# EAGLE design StepperSynth2.4_Interface (EAGLE 9.2.2)
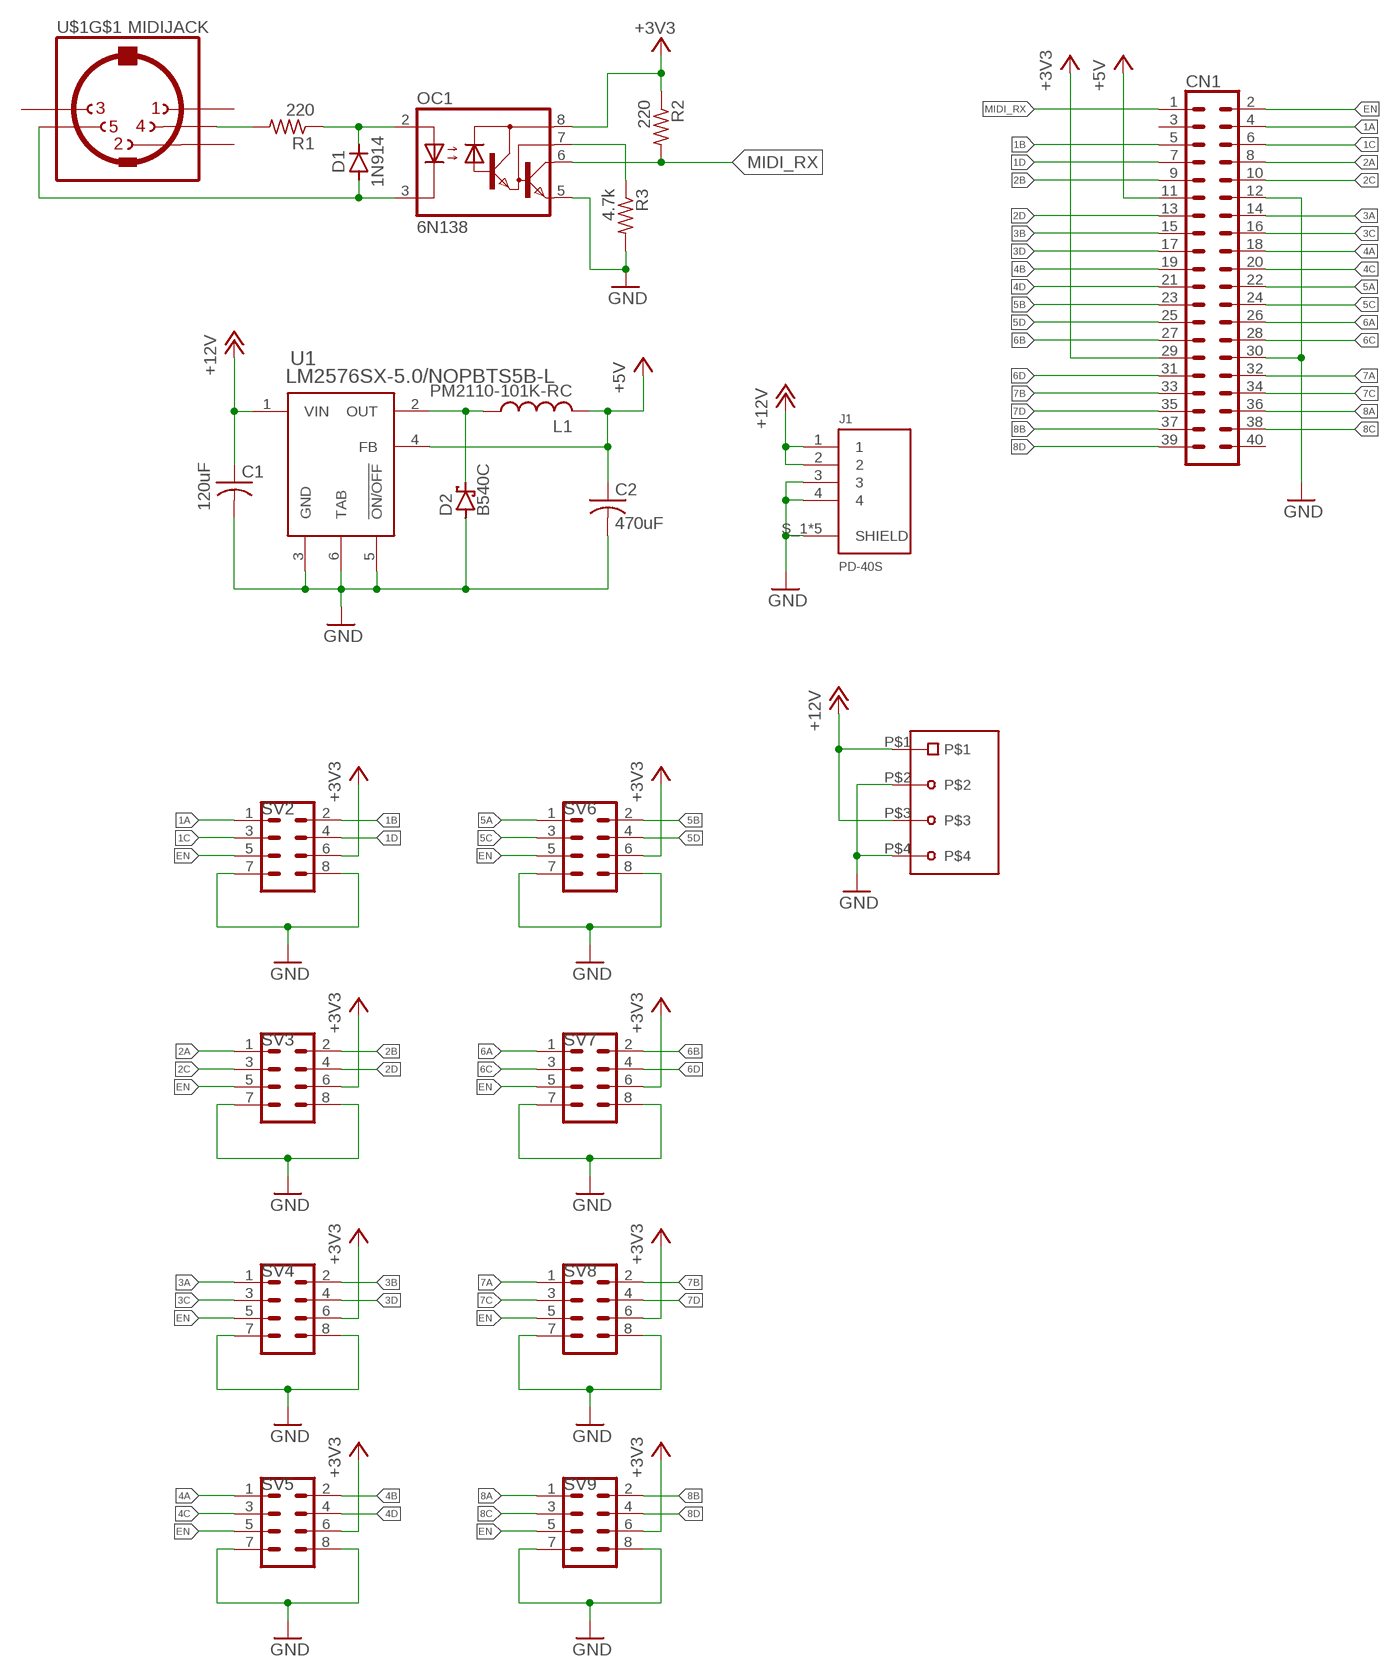
[diagram p0: schematic, sheet 1]

## Parts
C1  120uF  20SVPF120MPCAP_SVP_C6-L  [PCAP_SVP_C6-L]
C2  470uF  UUD1A471MNL1GSU2-P-L  [U2-P-L]
CN1  CONN_20X2_LOCK  [1X20_LOCK]
CN2  SCREW_TERMINAL_4POS_5MM  [4_POS-SCREW_TERM]
D1  1N914  [DO35-7]
D2  B540C  SCHOTTKY-DIODESMC  [SMC]
J1  PD-40S  [CUI_PD-40S]
L1  PM2110-101K-RC  [IND_PM2110]
OC1  6N138  [DIL08]
R1  220  R-US_0204/7  [0204/7]
R2  220  R-US_0204/7  [0204/7]
R3  4.7k  R-US_0204/7  [0204/7]
SV2  CONN_4X2_LOCK  [1X04_LOCK]
SV3  CONN_4X2_LOCK  [1X04_LOCK]
SV4  CONN_4X2_LOCK  [1X04_LOCK]
SV5  CONN_4X2_LOCK  [1X04_LOCK]
SV6  CONN_4X2_LOCK  [1X04_LOCK]
SV7  CONN_4X2_LOCK  [1X04_LOCK]
SV8  CONN_4X2_LOCK  [1X04_LOCK]
SV9  CONN_4X2_LOCK  [1X04_LOCK]
U1  LM2576SX-5.0/NOPBTS5B-L  [TS5B-L]
U$1  MIDIJACK  [CP-2350]

## Nets
1A: CN1.4 SV2.1
1B: CN1.5 SV2.2
1C: CN1.6 SV2.3
1D: CN1.7 SV2.4
2A: CN1.8 SV3.1
2B: CN1.9 SV3.2
2C: CN1.10 SV3.3
2D: CN1.13 SV3.4
3A: CN1.14 SV4.1
3B: CN1.15 SV4.2
3C: CN1.16 SV4.3
3D: CN1.17 SV4.4
4A: CN1.18 SV5.1
4B: CN1.19 SV5.2
4C: CN1.20 SV5.3
4D: CN1.21 SV5.4
5A: CN1.22 SV6.1
5B: CN1.23 SV6.2
5C: CN1.24 SV6.3
5D: CN1.25 SV6.4
6A: CN1.26 SV7.1
6B: CN1.27 SV7.2
6C: CN1.28 SV7.3
6D: CN1.31 SV7.4
7A: CN1.32 SV8.1
7B: CN1.33 SV8.2
7C: CN1.34 SV8.3
7D: CN1.35 SV8.4
8A: CN1.36 SV9.1
8B: CN1.37 SV9.2
8C: CN1.38 SV9.3
8D: CN1.39 SV9.4
+3V3: CN1.29 OC1.8(VCC) R2.1 SV2.6 SV3.6 SV4.6 SV5.6 SV6.6 SV7.6 SV8.6 SV9.6
+5V: C2.1(+) CN1.11 L1.2 U1.4(FB)
+12V: C1.1(+) CN2.P$1 CN2.P$3 J1.1 J1.2 U1.1(VIN)
EN: CN1.2 SV2.5 SV3.5 SV4.5 SV5.5 SV6.5 SV7.5 SV8.5 SV9.5
GND: C1.2(-) C2.2(-) CN1.12 CN1.30 CN2.P$2 CN2.P$4 D2.A J1.3 J1.4 J1.S_1(SHIELD) J1.S_2(SHIELD) J1.S_3(SHIELD) J1.S_4(SHIELD) J1.S_5(SHIELD) OC1.5(GND) R3.2 SV2.7 SV2.8 SV3.7 SV3.8 SV4.7 SV4.8 SV5.7 SV5.8 SV6.7 SV6.8 SV7.7 SV7.8 SV8.7 SV8.8 SV9.7 SV9.8 U1.3(GND) U1.5(!ON/OFF) U1.6(TAB)
MIDI_RX: CN1.1 OC1.6(VO) R2.2
N$1: R1.2 U$1.4
N$2: D1.C OC1.2(A) R1.1
N$3: D1.A OC1.3(C) U$1.5
N$4: OC1.7(VB) R3.1
N$5: D2.C L1.1 U1.2(OUT)
Unconnected: CN1.3 CN1.40 U$1.1 U$1.2 U$1.3 U$1.PE1(MT) U$1.PE2(MT) U$1.PE(MT) U$1.PE@(MT)

## Library data of the parts
C1 = Stepper Synth 2.4:20SVPF120M; MANUFACTURER_PART_NUMBER: 20SVPF120M; VENDOR: Panasonic
C2 = Stepper Synth 2.4:UUD1A471MNL1GS; MANUFACTURER_PART_NUMBER: UUD1A471MNL1GS; VENDOR: Nichicon
CN1 = Stepper Synth 2.4:CONN_20X2_LOCK
CN2 = Stepper Synth 2.4:SCREW_TERMINAL_4POS_5MM
D1 = Stepper Synth 2.4:1N914
D2 = Stepper Synth 2.4:SCHOTTKY-DIODE: Schottky Diode
J1 = Stepper Synth 2.4:PD-40S: 4 Position , 7.5 A, Right Angle, Through Hole, Shielded, Power DIN Connector; CUI_PURCHASE_URL: https://www.cui.com/product/interconnect/dc-power-connectors/din/pd-40s?utm_source=snapeda.com&utm_medium=referral&utm_campaign=snapedaBOM; DESCRIPTION: 4 Position , 7.5 A, Right Angle, Through Hole, Shielded, Power DIN Connector; DIGI-KEY_PART_NUMBER: CP-7240-ND; DIGI-KEY_PURCHASE_URL: https://www.digikey.com/product-detail/en/cui-inc/PD-40S/CP-7240-ND/2119338?utm_source=snapeda&utm_medium=aggregator&utm_campaign=symbol; MF: CUI Inc.; MP: PD-40S; PACKAGE: None
L1 = Stepper Synth 2.4:PM2110-101K-RC; MANUFACTURER_PART_NUMBER: PM2110101KRC; VENDOR: Bourns Electronics
OC1 = Stepper Synth 2.4:6N138: MOTOROLA OPTO COUPLER; MF: VISHAY/TELEFUNKEN; MPN: 6N138; OC_FARNELL: 9860150; OC_NEWARK: 35K5294
R1-R3 = adafruit:R-US_: RESISTOR, American symbol
SV2-SV9 = Stepper Synth 2.4:CONN_4X2_LOCK
U1 = Stepper Synth 2.4:LM2576SX-5.0/NOPB; MANUFACTURER_PART_NUMBER: LM2576SX5.0NOPB; VENDOR: Texas Instruments
U$1 = Stepper Synth 2.4:MIDIJACK: DIN 5 jack also known as MIDI jack A modification of conn-hirshman:MAB5SH with two options for the grounding 'teeth'

## Board
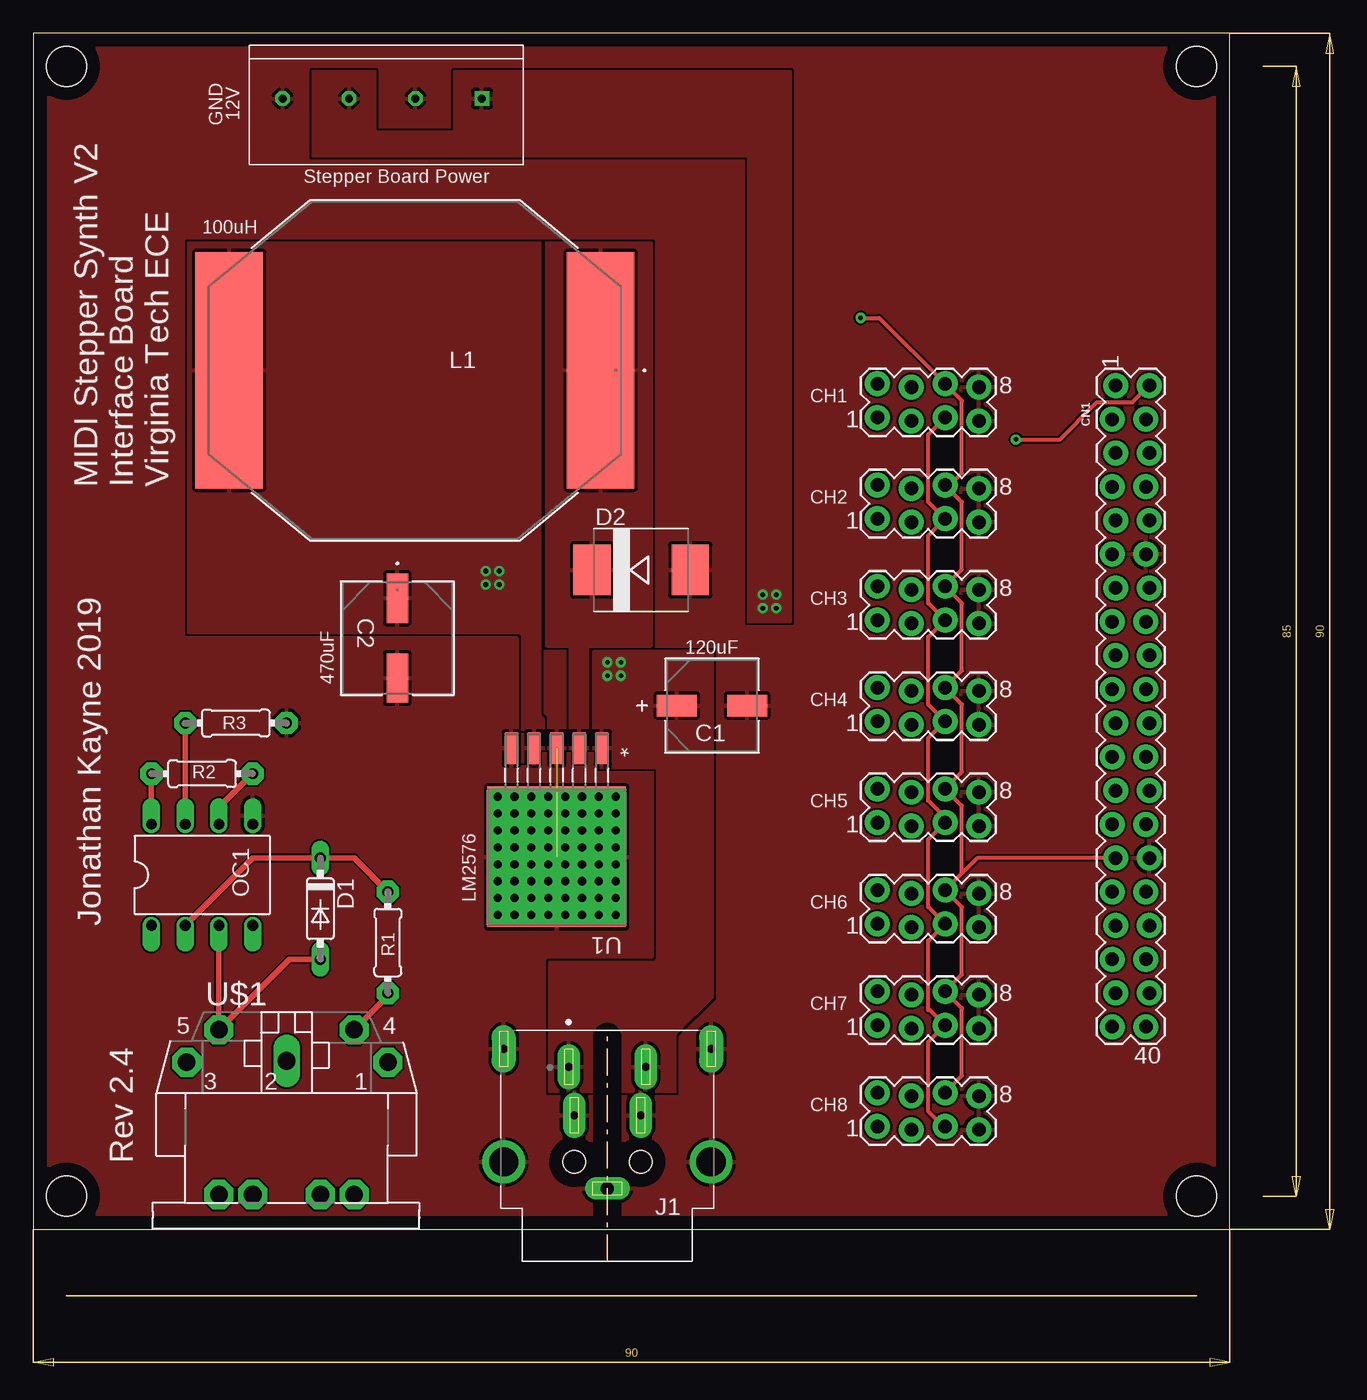
[diagram p1: board, top side]
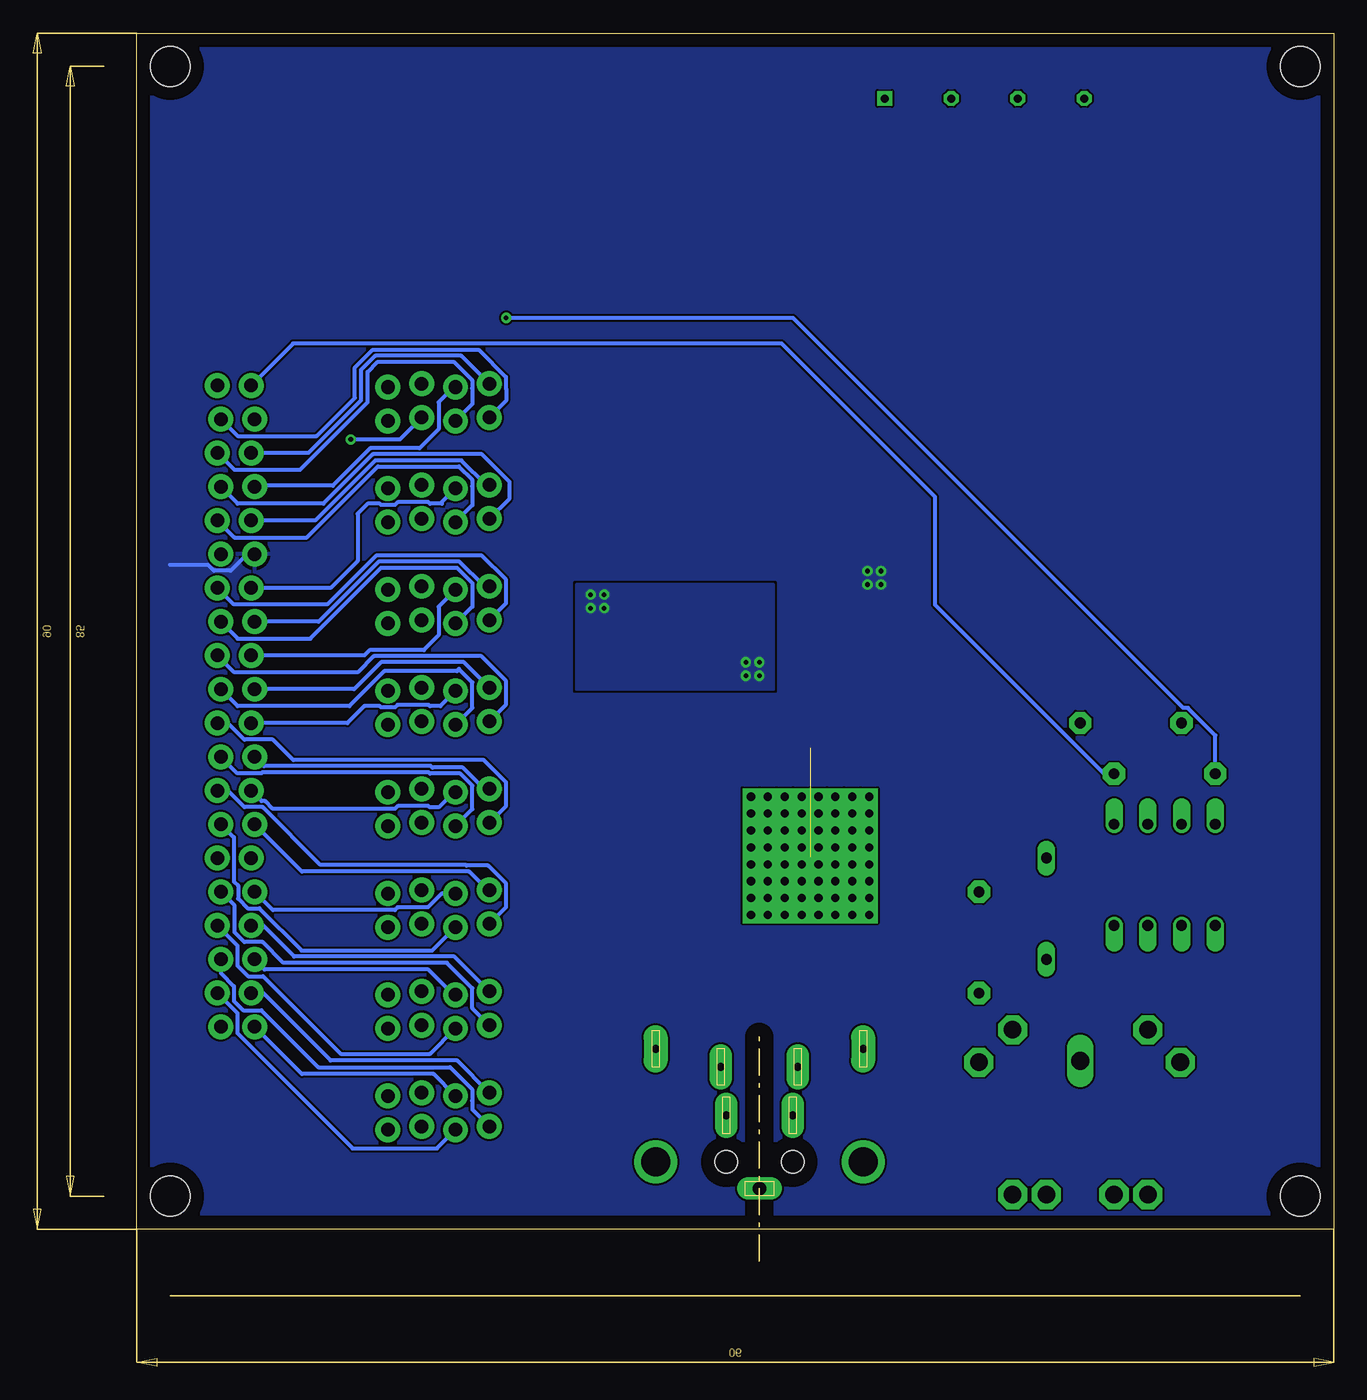
[diagram p2: board, bottom side, seen from below]

Size 90 x 90 mm. Coordinates in mm from the lower left corner, seen from the top.
Outline: 0,0 90,0 90,90 0,90 0,0
Copper layers (1*16): Top 0.035mm / dielectric 1.5mm / Bottom 0.035mm
Design rules "default": minimum track width 6mil, minimum drill 0.35mm, track to track 6mil, track to pad 6mil, pad to pad 6mil, via to via 6mil, smd to smd 6mil, copper to edge 40mil, drill to drill 6mil, minimum pad ring 10mil, minimum via ring 8mil, stop-mask expansion 4mil, vias tented up to drill 0mil, thermal gap 10mil
Holes 3 mm at 2.5,2.5 2.5,87.5 87.5,2.5 87.5,87.5

### Footprints (pad centres in the part's own frame; a part is rotated, then mirrored left to right if it is on the bottom)
PCAP_SVP_C6-L = smd 2.997 x 1.626: 1 -2.654,0; 2 2.654,0
U2-P-L = smd 3.708 x 1.626: 1 -2.997,0; 2 2.997,0
1X20_LOCK = drill 1.016 pad 1.88: 1 0,0.127; 2 0,2.667; 3 2.54,-0.127; 4 2.54,2.413; 5 5.08,0.127; 6 5.08,2.667; 7 7.62,-0.127; 8 7.62,2.413; 9 10.16,0.127; 10 10.16,2.667; 11 12.7,-0.127; 12 12.7,2.413; 13 15.24,0.127; 14 15.24,2.667; 15 17.78,-0.127; 16 17.78,2.413; 17 20.32,0.127; 18 20.32,2.667; 19 22.86,-0.127; 20 22.86,2.413; 21 25.4,0.127; 22 25.4,2.667; 23 27.94,-0.127; 24 27.94,2.413; 25 30.48,0.127; 26 30.48,2.667; 27 33.02,-0.127; 28 33.02,2.413; 29 35.56,0.127; 30 35.56,2.667; 31 38.1,-0.127; 32 38.1,2.413; 33 40.64,0.127; 34 40.64,2.667; 35 43.18,-0.127; 36 43.18,2.413; 37 45.72,0.127; 38 45.72,2.667; 39 48.26,-0.127; 40 48.26,2.413
4_POS-SCREW_TERM = drill 0.6 square: P$1 -2,0 | drill 0.6 octagon: P$2 3,0; P$3 8,0; P$4 13,0
DO35-7 = drill 0.813 long: A 3.81,0; C -3.81,0
SMC = smd 2.8 x 3.8: A 3.7,0; C -3.7,0
CUI_PD-40S = drill 0.6 pad 1.7 long: 1 2.9,-7.15; 2 -2.9,-7.15; 3 2.5,-3.5; 4 -2.5,-3.5 | drill 1 pad 1.7 long: S_1 0,2 | drill 2.2: S_2 -7.8,0; S_3 7.8,0 | drill 0.6 pad 1.8 long: S_4 -7.8,-8.5; S_5 7.8,-8.5 | hole 1.7: -2.5,0; 2.5,0
IND_PM2110 = smd 5.08 x 17.78: 1 -13.97,0; 2 13.97,0
DIL08 = drill 0.813 offset: 1 -3.81,-3.81; 2 -1.27,-3.81; 3 1.27,-3.81; 4 3.81,-3.81; 5 3.81,3.81; 6 1.27,3.81; 7 -1.27,3.81; 8 -3.81,3.81
0204/7 = drill 0.813 pad 1.676 octagon: 1 -3.81,0; 2 3.81,0
1X04_LOCK = drill 1.016 pad 1.88: 1 0,0.127; 2 0,2.667; 3 2.54,-0.127; 4 2.54,2.413; 5 5.08,0.127; 6 5.08,2.667; 7 7.62,-0.127; 8 7.62,2.413
TS5B-L = smd 0.965 x 2.388: 1 -3.404,-8.23; 2 -1.702,-8.23; 3 0,-8.23; 4 1.702,-8.23; 5 3.404,-8.23 | smd 10.414 x 10.566: 6 0,-0.051 | drill 0.61 pad 1.27 square: P$1 -4.445,4.318; P$2 -3.175,4.318; P$3 -1.905,4.318; P$4 -0.635,4.318; P$5 0.635,4.318; P$6 1.905,4.318; P$7 3.175,4.318; P$8 4.445,4.318; P$9 -4.445,3.048; P$10 -3.175,3.048; P$11 -1.905,3.048; P$12 -0.635,3.048; P$13 0.635,3.048; P$14 1.905,3.048; P$15 3.175,3.048; P$16 4.445,3.048; P$17 -4.445,1.778; P$18 -3.175,1.778; P$19 -1.905,1.778; P$20 -0.635,1.778; P$21 0.635,1.778; P$22 1.905,1.778; P$23 3.175,1.778; P$24 4.445,1.778; P$25 -4.445,0.508; P$26 -3.175,0.508; P$27 -1.905,0.508; P$28 -0.635,0.508; P$29 0.635,0.508; P$30 1.905,0.508; P$31 3.175,0.508; P$32 4.445,0.508; P$33 -4.445,-0.762; P$34 -3.175,-0.762; P$35 -1.905,-0.762; P$36 -0.635,-0.762; P$37 0.635,-0.762; P$38 1.905,-0.762; P$39 3.175,-0.762; P$40 4.445,-0.762; P$41 -4.445,-2.032; P$42 -3.175,-2.032; P$43 -1.905,-2.032; P$44 -0.635,-2.032; P$45 0.635,-2.032; P$46 1.905,-2.032; P$47 3.175,-2.032; P$48 4.445,-2.032; P$49 -4.445,-3.302; P$50 -3.175,-3.302; P$51 -1.905,-3.302; P$52 -0.635,-3.302; P$53 0.635,-3.302; P$54 1.905,-3.302; P$55 3.175,-3.302; P$56 4.445,-3.302; P$57 -4.445,-4.572; P$58 -3.175,-4.572; P$59 -1.905,-4.572; P$60 -0.635,-4.572; P$61 0.635,-4.572; P$62 1.905,-4.572; P$63 3.175,-4.572; P$64 4.445,-4.572
CP-2350 = drill 1.321 pad 2.184 octagon: 1 7.62,12.58; 3 -7.52,12.58; 4 5.08,15.02; 5 -5.08,15.02; PE -2.54,2.62; PE1 -5.08,2.62; PE2 5.08,2.62; PE@ 2.54,2.62 | drill 1.321 long: 2 0,12.68

### Placement (x,y rotation side)
C1  51.05,39.41 0 top
C2  27.39,44.49 270 top
CN1  81.28,63.5 270 top
CN2  31.75,85.09 180 top
D1  21.59,24.13 270 top
D2  45.72,49.61 0 top
J1  43.18,5.08 180 top
L1  28.7,64.64 180 top
OC1  12.7,26.67 0 top
R1  26.67,21.59 270 top
R2  12.7,34.29 0 top
R3  15.24,38.1 0 top
SV2  63.5,60.96 0 top
SV3  63.5,53.34 0 top
SV4  63.5,45.72 0 top
SV5  63.5,38.1 0 top
SV6  63.5,30.48 0 top
SV7  63.5,22.86 0 top
SV8  63.5,15.24 0 top
SV9  63.5,7.62 0 top
U1  39.37,27.98 180 top
U$1  19.05,0 0 top

### Tracks (layer width: path | path; a pad name or v marks a point on that pad's centre or on a via)
1A
  Bottom 0.305: CN1.4 82.42,59.69 76.48,59.69 73.61,62.56 73.61,64.84 72.26,66.19 64.31,66.19 62.26,64.14 62.26,63.27 62.23,63.25 62.23,62.36 SV2.1
1B
  Bottom 0.305: SV2.2 65.61,65.73 72.07,65.73 73.15,64.66 73.15,62.37 77.1,58.42 CN1.5
1C
  Bottom 0.305: CN1.6 82.68,57.15 77.72,57.15 72.64,62.23 72.64,64.52 71.88,65.28 66.19,65.28 64.8,63.89 64.8,63.27 64.77,63.25 64.77,62.1 SV2.3
1D
  Bottom 0.305: SV2.4 66.17,63.37 67.31,62.23 67.31,60.2 68.73,58.78 72.45,58.78 75.27,55.96 81.07,55.96 CN1.7
2A
  Bottom 0.305: SV3.1 61.98,54.99 61.98,56.24 64.05,58.32 72.26,58.32 75.97,54.61 82.42,54.61 CN1.8
2B
  Bottom 0.305: SV3.2 63.74,56.01 65.6,57.86 72.07,57.86 76.59,53.34 CN1.9
2C
  Bottom 0.305: CN1.10 82.68,52.07 77.22,52.07 71.88,57.4 65.79,57.4 64.8,56.41 64.8,55.91 64.77,55.88 64.77,54.48 SV3.3
2D
  Bottom 0.305: SV3.4 67.06,54.74 67.06,54.61 67.96,54.61 68.06,54.71 70.4,54.71 70.6,54.51 71.64,54.51 71.74,54.61 72.64,54.61 73.41,53.85 73.41,50.29 75.44,48.26 CN1.13
3A
  Bottom 0.305: SV4.1 62.23,47.12 62.23,48.88 64.05,50.7 72.01,50.7 75.69,47.02 82.7,47.02 CN1.14
3B
  Bottom 0.305: SV4.2 63.89,48.39 65.74,50.24 71.82,50.24 76.34,45.72 CN1.15
3C
  Bottom 0.305: CN1.16 82.42,44.45 76.96,44.45 71.63,49.78 65.93,49.78 64.77,48.62 64.77,46.86 SV4.3
3D
  Bottom 0.305: SV4.4 67.31,46.86 67.31,44.7 68.43,43.59 72.49,43.59 72.9,43.18 CN1.17
4A
  Bottom 0.305: SV5.1 62.23,39.5 62.23,41.26 64.1,43.13 72.19,43.13 73.41,41.91 82.68,41.91 CN1.18
4B
  Bottom 0.305: SV5.2 65.41,42.67 71.63,42.67 73.66,40.64 CN1.19
4C
  Bottom 0.305: SV5.3 64.77,39.24 64.77,41.15 65.79,42.16 65.94,42.01 71.38,42.01 74.02,39.37 82.42,39.37 CN1.20
4D
  Bottom 0.305: SV5.4 67.18,39.37 67.96,39.37 68.06,39.47 70.4,39.47 70.6,39.27 71.64,39.27 71.74,39.37 72.9,39.37 74.17,38.1 CN1.21
5A
  Bottom 0.305: SV6.1 62.23,31.88 62.23,33.64 63.9,35.31 78.23,35.31 79.78,36.85 81.92,36.85 83.17,38.1 CN1.22
5B
  Bottom 0.305: SV6.2 63.89,33.15 65.49,34.75 67.77,34.75 67.88,34.85 80.44,34.85 CN1.23
5C
  Bottom 0.305: SV6.3 64.77,31.62 64.77,33.38 65.68,34.29 67.96,34.29 68.06,34.39 80.56,34.39 80.64,34.31 82.45,34.31 CN1.24
5D
  Bottom 0.305: SV6.4 66.17,32.89 67.31,31.75 67.96,31.75 68.06,31.85 70.4,31.85 70.6,31.65 79.77,31.65 80.35,32.23 80.62,32.23 CN1.25
6A
  Bottom 0.305: SV7.1 62.23,24.26 62.23,26.02 63.59,27.38 65.23,27.38 65.28,27.43 76.2,27.43 80.54,31.77 81.92,31.77 83.17,33.02 CN1.26
6B
  Bottom 0.305: SV7.2 63.63,25.53 65.02,26.92 77.6,26.92 CN1.27
6C
  Bottom 0.305: CN1.28 82.7,29.49 82.7,26.17 82.4,25.86 82.4,24.88 81.67,24.16 80.8,24.16 77.62,20.98 67.79,20.98 SV7.3
6D
  Bottom 0.305: SV7.4 67.07,25.27 68.11,24.23 70.4,24.23 70.6,24.03 79.78,24.03 CN1.31
7A
  Bottom 0.305: SV8.1 64.77,16.64 64.77,18.14 66.69,20.07 78.99,20.07 80.54,21.61 81.92,21.61 82.65,22.34 82.65,24.36 CN1.32
7B
  Bottom 0.305: SV8.2 66.12,20.52 78.18,20.52 80.52,22.86 CN1.33
7C
  Bottom 0.305: CN1.34 82.45,21.36 82.45,19.86 81.64,19.05 80.52,19.05 74.68,13.21 67.94,13.21 SV8.3
7D
  Bottom 0.305: SV8.4 66.17,17.65 68.07,19.56 80.39,19.56 CN1.35
8A
  Bottom 0.305: CN1.36 83.69,19.29 82.7,18.3 82.7,17.18 82,16.48 80.64,16.48 76.34,12.19 66.44,12.19 64.8,10.55 64.8,9.68 64.77,9.65 64.77,9.02 SV9.1
8B
  Bottom 0.305: SV9.2 65.91,12.7 75.44,12.7 80.52,17.78 CN1.37
8C
  Bottom 0.305: CN1.38 82.45,16.28 82.45,14.78 73.77,6.1 67.44,6.1 SV9.3
8D
  Bottom 0.305: SV9.4 67.69,11.68 77.6,11.68 CN1.39
+3V3  (via drill 0.35)
  Top 0.305: SV9.6 69.85,11.56 69.85,16.64 SV8.6 69.85,19.18 69.85,24.26 SV7.6 69.85,26.8 | 69.85,26.8 69.85,31.88 SV6.6 69.85,34.42 69.85,39.5 SV5.6 69.85,42.04 69.85,47.12 SV4.6 69.85,49.66 69.85,54.74 SV3.6 68.96,56.01 69.85,56.9 69.85,62.36 SV2.6 63.63,68.58 v62.23,68.58 | CN1.29 70.99,27.94 69.85,26.8
  Top 0.406: OC1.8 R2.1
  Bottom 0.305: R2.1 8.89,37.18 10.96,39.24 11.3,39.24 40.64,68.58 v62.23,68.58
+5V  (via drill 0.35)
  Bottom 0.305: CN1.11 81.7,50.8 82.94,49.55 84.21,49.55 84.65,50 87.5,50
  other vias: 35.05,48.51 34.04,49.53 35.05,49.53 34.04,48.51
  pour Top: 38.35,35.05 38.35,38.35 38.1,38.61 38.1,43.69 38.1,74.17 11.68,74.17 11.68,44.96 17.27,44.96 36.58,44.96 36.83,44.7 36.83,35.05
  pour Bottom (rank 4): -1.27,91.44 91.44,91.44 91.44,-1.27 -1.27,-1.27
+12V  (via drill 0.35)
  other vias: 43.18,42.67 44.2,42.67 43.18,41.66 44.2,41.66 54.86,47.75 55.88,47.75 54.86,46.74 55.88,46.74
  pour Top: 42.16,34.8 51.05,34.8 51.05,43.43 42.16,43.43
  pour Top: 38.86,10.41 48.26,10.41 48.26,14.73 51.05,17.53 51.05,35.05 46.99,35.05 46.99,20.32 46.74,20.07 38.86,20.07
  pour Top: 21.08,87.12 25.65,87.12 25.65,82.55 31.75,82.55 31.75,87.12 56.9,87.12 56.9,45.72 53.85,45.72 53.85,80.77 21.08,80.77
  pour Bottom: 56.9,48.51 42.16,48.51 42.16,40.64 56.9,40.64
EN  (via drill 0.35)
  Top 0.305: SV9.5 68.45,7.75 67.31,8.89 67.31,14.1 SV8.5 67.44,16.51 67.31,16.51 67.31,21.72 SV7.5 67.31,24.26 67.31,29.34 SV6.5 68.58,30.99 67.31,32.26 67.31,36.96 SV5.5 67.31,39.5 67.31,44.58 SV4.5 67.31,47.12 67.31,52.2 SV3.5 67.31,54.74 67.31,59.82 SV2.5 | v73.91,59.44 77.22,59.44 80.01,62.23 82.68,62.23 CN1.2
  Bottom 0.305: SV2.5 70.23,59.44 v73.91,59.44
GND  (1 unrouted)
  pour Top (rank 4): -1.27,91.44 90.17,91.44 91.44,90.17 91.44,-1.27 -1.27,-1.27
MIDI_RX
  Top 0.406: R2.2 13.97,31.75 OC1.6
  Bottom 0.305: R2.2 17.27,34.29 29.97,46.99 29.97,55.12 41.5,66.65 78.26,66.65 CN1.1
N$1
  Top 0.406: U$1.4 26.67,17.56 R1.2
N$2
  Top 0.406: R1.1 24.13,27.94 D1.C 16.51,27.94 OC1.2
N$3
  Top 0.406: OC1.3 U$1.5 19.27,20.32 D1.A
N$4
  Top 0.406: R3.1 OC1.7
N$5
  pour Top: 41.66,35.31 41.66,43.94 45.47,43.94 46.48,43.94 46.48,56.13 46.48,74.17 38.61,74.17 38.61,43.94 39.62,43.94 40.39,43.94 40.39,35.31

### Text on the board
tPlace: GND | 12V | Stepper Board Power | 100uH | CH1 | MIDI Stepper Synth V2 / Interface Board / Virginia Tech ECE | CH2 | CH3 | 120uF | 470uF | CH4 | CH5 | LM2576 | CH6 | Jonathan Kayne 2019 | CH7 | CH8
tNames: Rev 2.4
Reference: +5V | MIDI Rx | +3.3V